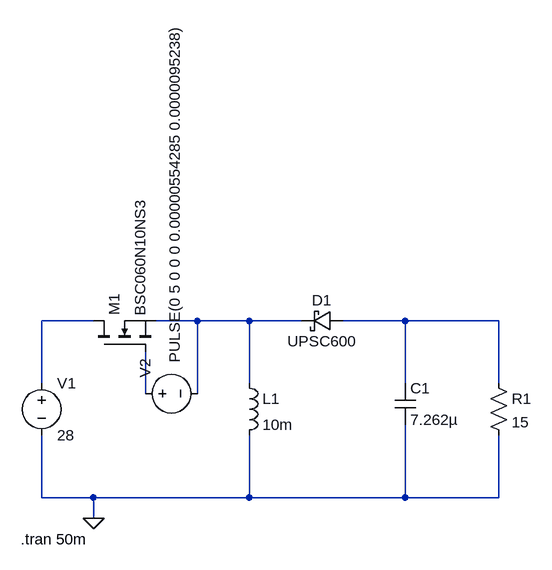
[diagram p0: schematic buckboost_circuit.asc]
buckboost_circuit.asc, the LTspice schematic file:
Version 4
SHEET 1 880 680
WIRE -112 16 -192 16
WIRE 48 16 -16 16
WIRE 128 16 48 16
WIRE 208 16 128 16
WIRE 368 16 272 16
WIRE 512 16 368 16
WIRE -192 112 -192 16
WIRE 128 112 128 16
WIRE 368 112 368 16
WIRE 512 112 512 16
WIRE -32 128 -32 64
WIRE 48 128 48 16
WIRE -192 288 -192 192
WIRE -112 288 -192 288
WIRE 128 288 128 192
WIRE 128 288 -112 288
WIRE 368 288 368 176
WIRE 368 288 128 288
WIRE 512 288 512 192
WIRE 512 288 368 288
WIRE -112 320 -112 288
FLAG -112 320 0
SYMBOL voltage -192 96 R0
WINDOW 123 0 0 Left 0
WINDOW 39 0 0 Left 0
SYMATTR InstName V1
SYMATTR Value 28
SYMBOL ind 112 96 R0
SYMATTR InstName L1
SYMATTR Value 10m
SYMBOL cap 352 112 R0
SYMATTR InstName C1
SYMATTR Value 7.262µ
SYMBOL res 496 96 R0
SYMATTR InstName R1
SYMATTR Value 15
SYMBOL voltage -48 128 R270
WINDOW 123 0 0 Left 0
WINDOW 39 0 0 Left 0
WINDOW 3 47 61 Left 2
SYMATTR Value PULSE(0 5 0 0 0 0.00000554285 0.0000095238)
SYMATTR InstName V2
SYMBOL schottky 272 0 R90
WINDOW 0 0 32 VBottom 2
WINDOW 3 32 32 VTop 2
SYMATTR InstName D1
SYMATTR Value UPSC600
SYMATTR Description Diode
SYMATTR Type diode
SYMBOL nmos -112 64 R270
SYMATTR InstName M1
SYMATTR Value BSC060N10NS3
TEXT -224 352 Left 2 !.tran 50m

The netlist it stands for:
* buckboost_circuit.asc
V1 N001 0 28
L1 N002 0 10m
C1 N003 0 7.262µ
R1 N003 0 15
V2 N004 N002 PULSE(0 5 0 0 0 0.00000554285 0.0000095238)
D1 N003 N002 UPSC600
M1 N001 N004 N002 N002 BSC060N10NS3
.model D D
.lib standard.dio
.model NMOS NMOS
.model PMOS PMOS
.lib standard.mos
.tran 50m
.backanno
.end